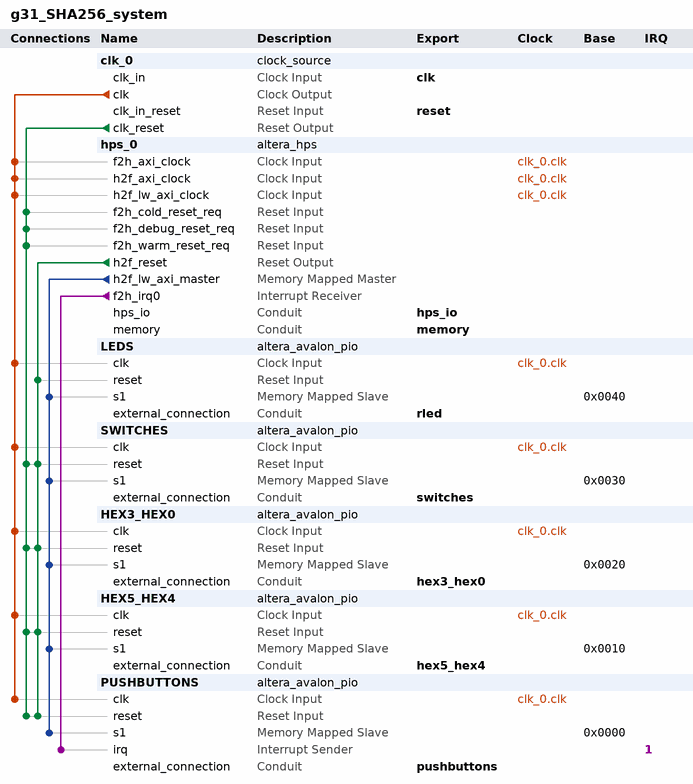
[diagram p0: system contents]
# Platform Designer (Qsys) system g31_SHA256_system, Cyclone V 5CSEMA5F31C6
# Parameters at their usual value, and those the tool derives, are not listed.
package require -exact qsys 22.1
create_system g31_SHA256_system
set_project_property DEVICE_FAMILY {Cyclone V}
set_project_property DEVICE 5CSEMA5F31C6

add_instance clk_0 clock_source 22.1
set_instance_parameter_value clk_0 clockFrequency 50000000

add_instance hps_0 altera_hps 22.1
set_instance_parameter_value hps_0 CAN0_Mode CAN
set_instance_parameter_value hps_0 CAN0_PinMuxing {HPS I/O Set 0}
set_instance_parameter_value hps_0 EMAC1_Mode RGMII
set_instance_parameter_value hps_0 EMAC1_PinMuxing {HPS I/O Set 0}
set_instance_parameter_value hps_0 F2SCLK_COLDRST_Enable true
set_instance_parameter_value hps_0 F2SCLK_DBGRST_Enable true
set_instance_parameter_value hps_0 F2SCLK_WARMRST_Enable true
set_instance_parameter_value hps_0 F2SINTERRUPT_Enable true
set_instance_parameter_value hps_0 F2S_Width 2
set_instance_parameter_value hps_0 FPGA_PERIPHERAL_OUTPUT_CLOCK_FREQ_EMAC0_GTX_CLK 125
set_instance_parameter_value hps_0 FPGA_PERIPHERAL_OUTPUT_CLOCK_FREQ_EMAC0_MD_CLK 2.5
set_instance_parameter_value hps_0 FPGA_PERIPHERAL_OUTPUT_CLOCK_FREQ_EMAC1_GTX_CLK 125
set_instance_parameter_value hps_0 FPGA_PERIPHERAL_OUTPUT_CLOCK_FREQ_EMAC1_MD_CLK 2.5
set_instance_parameter_value hps_0 HPS_PROTOCOL DDR3
set_instance_parameter_value hps_0 I2C0_Mode I2C
set_instance_parameter_value hps_0 I2C0_PinMuxing {HPS I/O Set 1}
set_instance_parameter_value hps_0 I2C1_Mode N/A
set_instance_parameter_value hps_0 I2C1_PinMuxing Unused
set_instance_parameter_value hps_0 LWH2F_Enable true
set_instance_parameter_value hps_0 MEM_BANKADDR_WIDTH 3
set_instance_parameter_value hps_0 MEM_CLK_FREQ 400.0
set_instance_parameter_value hps_0 MEM_COL_ADDR_WIDTH 10
set_instance_parameter_value hps_0 MEM_DQ_WIDTH 40
set_instance_parameter_value hps_0 MEM_DRV_STR RZQ/6
set_instance_parameter_value hps_0 MEM_ROW_ADDR_WIDTH 15
set_instance_parameter_value hps_0 MEM_RTT_NOM RZQ/6
set_instance_parameter_value hps_0 MEM_RTT_WR {Dynamic ODT off}
set_instance_parameter_value hps_0 MEM_TCL 7
set_instance_parameter_value hps_0 MEM_TFAW_NS 30.0
set_instance_parameter_value hps_0 MEM_TRAS_NS 35.0
set_instance_parameter_value hps_0 MEM_TRCD_NS 13.75
set_instance_parameter_value hps_0 MEM_TRFC_NS 260.0
set_instance_parameter_value hps_0 MEM_TRP_NS 13.75
set_instance_parameter_value hps_0 MEM_TRRD_NS 10.0
set_instance_parameter_value hps_0 MEM_TRTP_NS 10.0
set_instance_parameter_value hps_0 MEM_VENDOR JEDEC
set_instance_parameter_value hps_0 MEM_WTCL 6
set_instance_parameter_value hps_0 QSPI_Mode {1 SS}
set_instance_parameter_value hps_0 QSPI_PinMuxing {HPS I/O Set 0}
set_instance_parameter_value hps_0 REF_CLK_FREQ 25.0
set_instance_parameter_value hps_0 S2FCLK_USER2CLK 5
set_instance_parameter_value hps_0 S2F_Width 2
set_instance_parameter_value hps_0 SDIO_Mode {4-bit Data}
set_instance_parameter_value hps_0 SDIO_PinMuxing {HPS I/O Set 0}
set_instance_parameter_value hps_0 SPIM0_Mode {Single Slave Select}
set_instance_parameter_value hps_0 SPIM0_PinMuxing {HPS I/O Set 0}
set_instance_parameter_value hps_0 SPIM1_Mode N/A
set_instance_parameter_value hps_0 SPIM1_PinMuxing Unused
set_instance_parameter_value hps_0 STM_Enable true
set_instance_parameter_value hps_0 TIMING_BOARD_AC_SKEW 0.02
set_instance_parameter_value hps_0 TIMING_BOARD_AC_TO_CK_SKEW 0.0
set_instance_parameter_value hps_0 TIMING_BOARD_DQ_TO_DQS_SKEW 0.0
set_instance_parameter_value hps_0 TIMING_BOARD_MAX_CK_DELAY 0.6
set_instance_parameter_value hps_0 TIMING_BOARD_MAX_DQS_DELAY 0.6
set_instance_parameter_value hps_0 TIMING_BOARD_SKEW_BETWEEN_DQS 0.02
set_instance_parameter_value hps_0 TIMING_BOARD_SKEW_CKDQS_DIMM_MAX 0.01
set_instance_parameter_value hps_0 TIMING_BOARD_SKEW_CKDQS_DIMM_MIN -0.01
set_instance_parameter_value hps_0 TIMING_BOARD_SKEW_WITHIN_DQS 0.02
set_instance_parameter_value hps_0 TIMING_TDH 45
set_instance_parameter_value hps_0 TIMING_TDQSCK 225
set_instance_parameter_value hps_0 TIMING_TDQSQ 100
set_instance_parameter_value hps_0 TIMING_TDQSS 0.27
set_instance_parameter_value hps_0 TIMING_TDS 10
set_instance_parameter_value hps_0 TIMING_TDSH 0.18
set_instance_parameter_value hps_0 TIMING_TDSS 0.18
set_instance_parameter_value hps_0 TIMING_TIH 120
set_instance_parameter_value hps_0 TIMING_TIS 170
set_instance_parameter_value hps_0 TIMING_TQSH 0.4
set_instance_parameter_value hps_0 TRACE_Mode HPS
set_instance_parameter_value hps_0 TRACE_PinMuxing {HPS I/O Set 0}
set_instance_parameter_value hps_0 UART0_Mode {No Flow Control}
set_instance_parameter_value hps_0 UART0_PinMuxing {HPS I/O Set 2}
set_instance_parameter_value hps_0 USB1_Mode SDR
set_instance_parameter_value hps_0 USB1_PinMuxing {HPS I/O Set 0}
set_instance_parameter_value hps_0 desired_cfg_clk_mhz 100.0
set_instance_parameter_value hps_0 desired_qspi_clk_mhz 400.0

add_instance LEDS altera_avalon_pio 22.1
set_instance_parameter_value LEDS direction Output
set_instance_parameter_value LEDS width 10

add_instance SWITCHES altera_avalon_pio 22.1
set_instance_parameter_value SWITCHES direction Input
set_instance_parameter_value SWITCHES width 10

add_instance HEX3_HEX0 altera_avalon_pio 22.1
set_instance_parameter_value HEX3_HEX0 direction Output
set_instance_parameter_value HEX3_HEX0 width 32

add_instance HEX5_HEX4 altera_avalon_pio 22.1
set_instance_parameter_value HEX5_HEX4 direction Output
set_instance_parameter_value HEX5_HEX4 width 16

add_instance PUSHBUTTONS altera_avalon_pio 22.1
set_instance_parameter_value PUSHBUTTONS captureEdge true
set_instance_parameter_value PUSHBUTTONS direction Input
set_instance_parameter_value PUSHBUTTONS edgeType FALLING
set_instance_parameter_value PUSHBUTTONS generateIRQ true
set_instance_parameter_value PUSHBUTTONS irqType EDGE
set_instance_parameter_value PUSHBUTTONS width 4

# connections
add_connection clk_0.clk HEX3_HEX0.clk clock
add_connection clk_0.clk HEX5_HEX4.clk clock
add_connection clk_0.clk hps_0.f2h_axi_clock clock
add_connection clk_0.clk hps_0.h2f_axi_clock clock
add_connection clk_0.clk hps_0.h2f_lw_axi_clock clock
add_connection clk_0.clk LEDS.clk clock
add_connection clk_0.clk PUSHBUTTONS.clk clock
add_connection clk_0.clk SWITCHES.clk clock
add_connection clk_0.clk_reset HEX3_HEX0.reset reset
add_connection clk_0.clk_reset HEX5_HEX4.reset reset
add_connection clk_0.clk_reset hps_0.f2h_cold_reset_req reset
add_connection clk_0.clk_reset hps_0.f2h_debug_reset_req reset
add_connection clk_0.clk_reset hps_0.f2h_warm_reset_req reset
add_connection clk_0.clk_reset PUSHBUTTONS.reset reset
add_connection clk_0.clk_reset SWITCHES.reset reset
add_connection hps_0.h2f_reset HEX3_HEX0.reset reset
add_connection hps_0.h2f_reset HEX5_HEX4.reset reset
add_connection hps_0.h2f_reset LEDS.reset reset
add_connection hps_0.h2f_reset PUSHBUTTONS.reset reset
add_connection hps_0.h2f_reset SWITCHES.reset reset
add_connection hps_0.h2f_lw_axi_master HEX3_HEX0.s1 avalon
set_connection_parameter_value hps_0.h2f_lw_axi_master/HEX3_HEX0.s1 baseAddress 0x0020
add_connection hps_0.h2f_lw_axi_master HEX5_HEX4.s1 avalon
set_connection_parameter_value hps_0.h2f_lw_axi_master/HEX5_HEX4.s1 baseAddress 0x0010
add_connection hps_0.h2f_lw_axi_master LEDS.s1 avalon
set_connection_parameter_value hps_0.h2f_lw_axi_master/LEDS.s1 baseAddress 0x0040
add_connection hps_0.h2f_lw_axi_master PUSHBUTTONS.s1 avalon
set_connection_parameter_value hps_0.h2f_lw_axi_master/PUSHBUTTONS.s1 baseAddress 0x0000
add_connection hps_0.h2f_lw_axi_master SWITCHES.s1 avalon
set_connection_parameter_value hps_0.h2f_lw_axi_master/SWITCHES.s1 baseAddress 0x0030
add_connection hps_0.f2h_irq0 PUSHBUTTONS.irq interrupt
set_connection_parameter_value hps_0.f2h_irq0/PUSHBUTTONS.irq irqNumber 1

# exported interfaces
add_interface clk clock sink
set_interface_property clk EXPORT_OF clk_0.clk_in
add_interface hex3_hex0 conduit end
set_interface_property hex3_hex0 EXPORT_OF HEX3_HEX0.external_connection
add_interface hex5_hex4 conduit end
set_interface_property hex5_hex4 EXPORT_OF HEX5_HEX4.external_connection
add_interface hps_io conduit end
set_interface_property hps_io EXPORT_OF hps_0.hps_io
add_interface memory conduit end
set_interface_property memory EXPORT_OF hps_0.memory
add_interface pushbuttons conduit end
set_interface_property pushbuttons EXPORT_OF PUSHBUTTONS.external_connection
add_interface reset reset sink
set_interface_property reset EXPORT_OF clk_0.clk_in_reset
add_interface rled conduit end
set_interface_property rled EXPORT_OF LEDS.external_connection
add_interface switches conduit end
set_interface_property switches EXPORT_OF SWITCHES.external_connection

set_interconnect_requirement {$system} qsys_mm.clockCrossingAdapter HANDSHAKE
set_interconnect_requirement {$system} qsys_mm.enableEccProtection FALSE
set_interconnect_requirement {$system} qsys_mm.insertDefaultSlave FALSE
set_interconnect_requirement {$system} qsys_mm.maxAdditionalLatency 1

save_system g31_SHA256_system.qsys
